# EAGLE schematic ES_3340_6HP_Rev_3 (EAGLE 9.2.1)
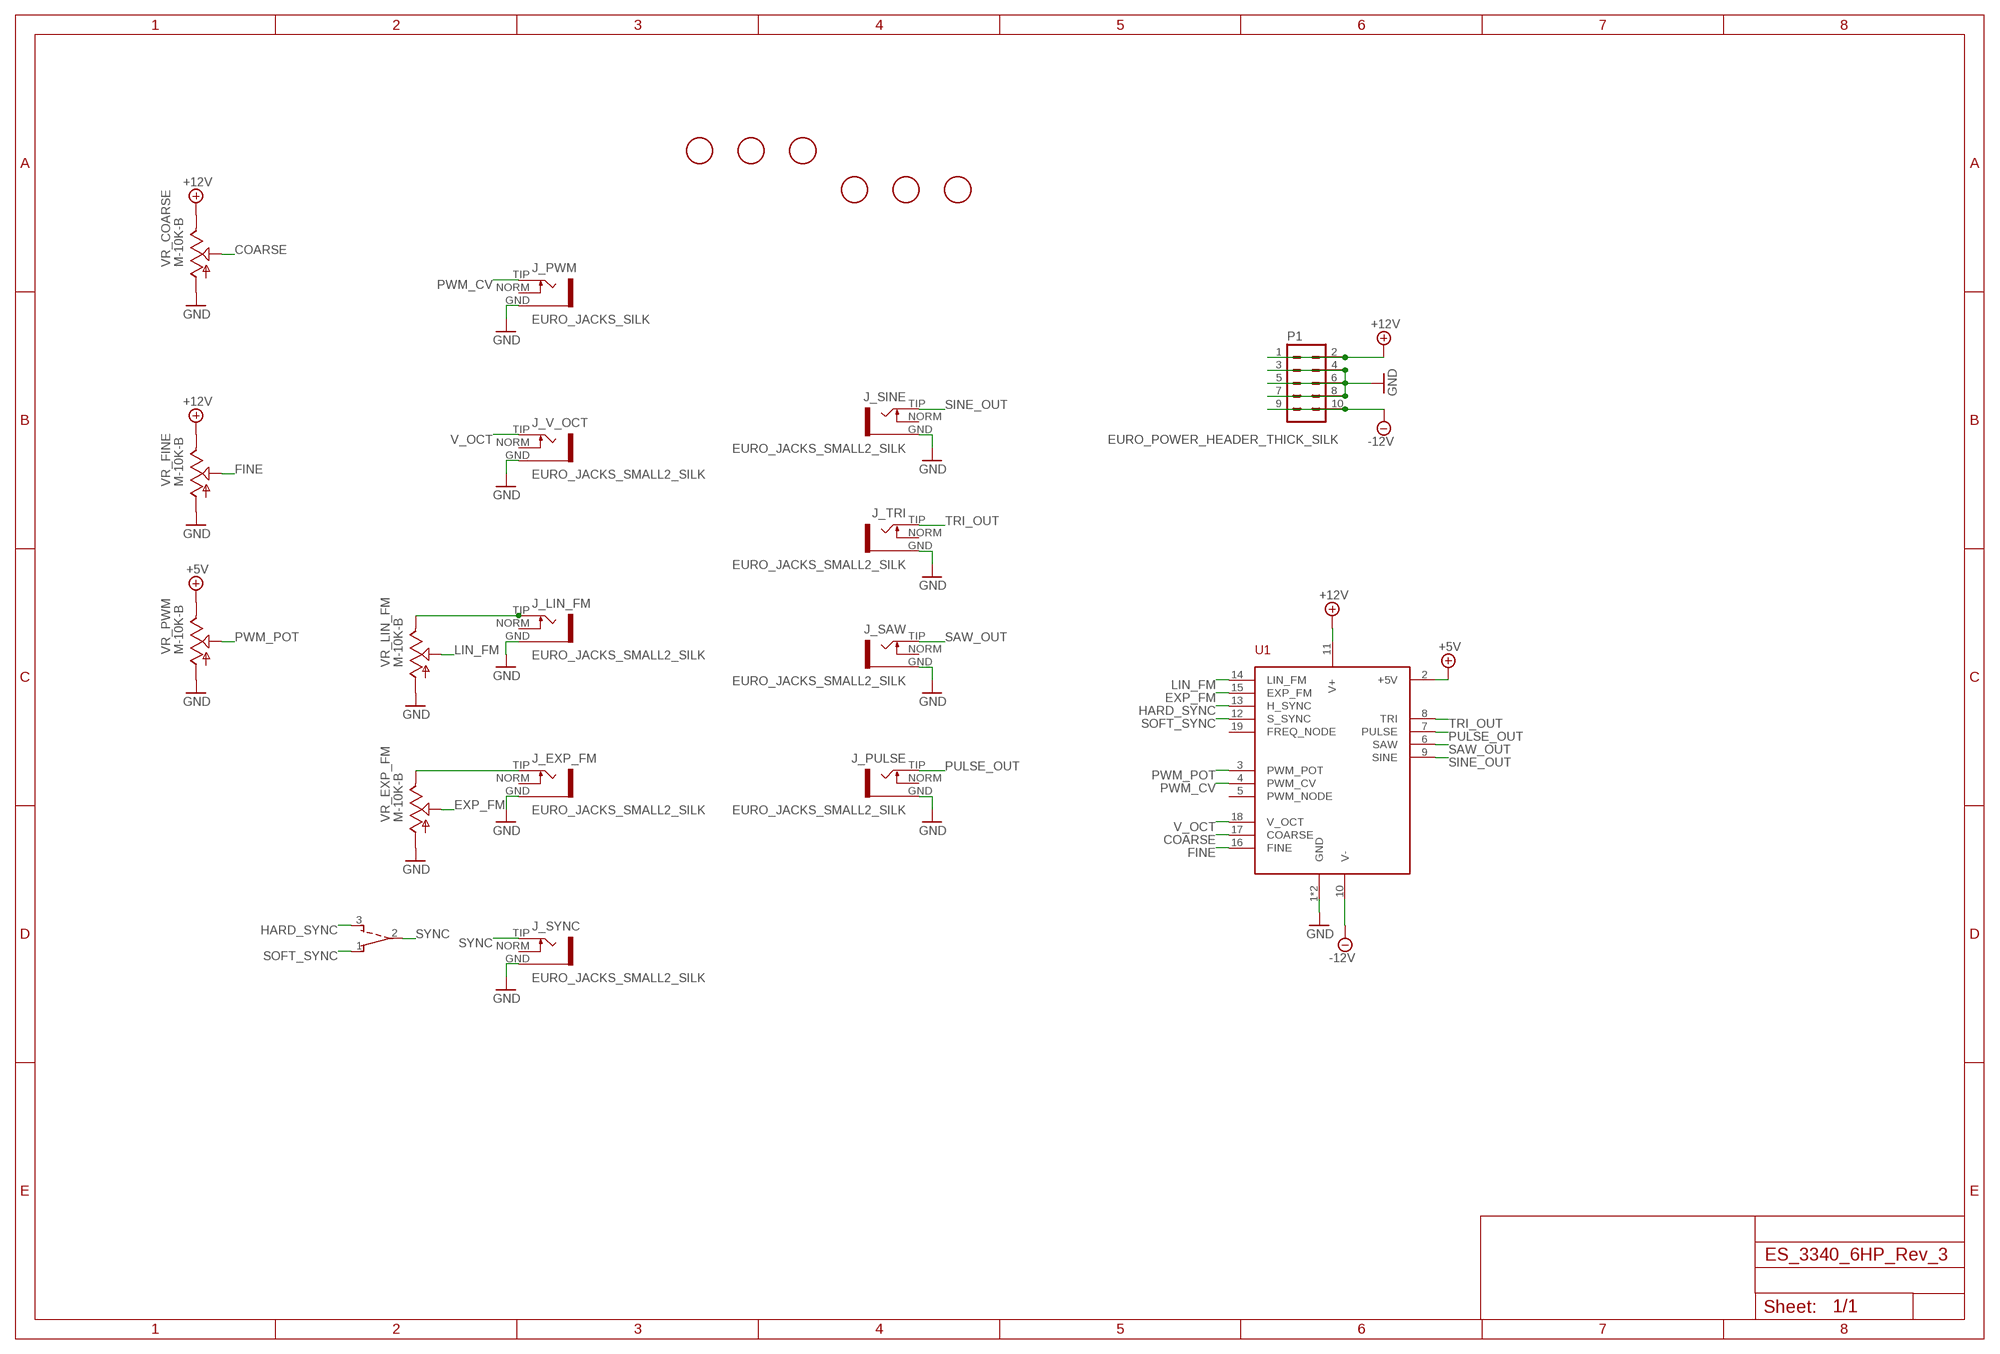
[diagram p0: schematic, sheet 1]

## Parts
FD1  FIDUCIAL  [FIDUCIAL_1MM]
FD2  FIDUCIAL  [FIDUCIAL_1MM]
FD3  FIDUCIAL  [FIDUCIAL_1MM]
FD4  FIDUCIAL  [FIDUCIAL_1MM]
FD5  FIDUCIAL  [FIDUCIAL_1MM]
FD6  FIDUCIAL  [FIDUCIAL_1MM]
J_EXP_FM  EURO_JACKS_SMALL2_SILK  [S_JACK_SMALL2_SILK]
J_LIN_FM  EURO_JACKS_SMALL2_SILK  [S_JACK_SMALL2_SILK]
J_PULSE  EURO_JACKS_SMALL2_SILK  [S_JACK_SMALL2_SILK]
J_PWM  EURO_JACKS_SILK  [S_JACK_SILK]
J_SAW  EURO_JACKS_SMALL2_SILK  [S_JACK_SMALL2_SILK]
J_SINE  EURO_JACKS_SMALL2_SILK  [S_JACK_SMALL2_SILK]
J_SYNC  EURO_JACKS_SMALL2_SILK  [S_JACK_SMALL2_SILK]
J_TRI  EURO_JACKS_SMALL2_SILK  [S_JACK_SMALL2_SILK]
J_V_OCT  EURO_JACKS_SMALL2_SILK  [S_JACK_SMALL2_SILK]
P1  EURO_POWER_HEADER_THICK_SILK  [2X5_LOCK]
SW1  TOGGLE_ON-ON  [TOGGLE_ON-ON]
U1  ES_3340_V2  [ES_3340_V2]
VR_COARSE  M-10K-B  POT_9MM_SNAP-IN__  [9MM_SNAP-IN_POT_SILK]
VR_EXP_FM  M-10K-B  POT_9MM_SNAP-IN__  [9MM_SNAP-IN_POT_SILK]
VR_FINE  M-10K-B  POT_9MM_SNAP-IN__  [9MM_SNAP-IN_POT_SILK]
VR_LIN_FM  M-10K-B  POT_9MM_SNAP-IN__  [9MM_SNAP-IN_POT_SILK]
VR_PWM  M-10K-B  POT_9MM_SNAP-IN__  [9MM_SNAP-IN_POT_SILK]

## Nets
+5V: U1.2(+5V) VR_PWM.3
+12V: P1.1 P1.2 U1.11(V+) VR_COARSE.3 VR_FINE.3
-12V: P1.9 P1.10 U1.10(V-)
COARSE: U1.17(COARSE) VR_COARSE.2
EXP_FM: U1.15(EXP_FM) VR_EXP_FM.2
FINE: U1.16(FINE) VR_FINE.2
GND: J_EXP_FM.GND J_LIN_FM.GND J_PULSE.GND J_PWM.GND J_SAW.GND J_SINE.GND J_SYNC.GND J_TRI.GND J_V_OCT.GND P1.3 P1.4 P1.5 P1.6 P1.7 P1.8 U1.1(GND) U1.20(GND) VR_COARSE.1 VR_EXP_FM.1 VR_FINE.1 VR_LIN_FM.1 VR_PWM.1
HARD_SYNC: SW1.3(S) U1.13(H_SYNC)
LIN_FM: U1.14(LIN_FM) VR_LIN_FM.2
N$1: J_LIN_FM.TIP VR_LIN_FM.3
N$2: J_EXP_FM.TIP VR_EXP_FM.3
PULSE_OUT: J_PULSE.TIP U1.7(PULSE)
PWM_CV: J_PWM.TIP U1.4(PWM_CV)
PWM_POT: U1.3(PWM_POT) VR_PWM.2
SAW_OUT: J_SAW.TIP U1.6(SAW)
SINE_OUT: J_SINE.TIP U1.9(SINE)
SOFT_SYNC: SW1.1(O) U1.12(S_SYNC)
SYNC: J_SYNC.TIP SW1.2(P)
TRI_OUT: J_TRI.TIP U1.8(TRI)
V_OCT: J_V_OCT.TIP U1.18(V_OCT)
Unconnected: J_EXP_FM.NORM J_LIN_FM.NORM J_PULSE.NORM J_PWM.NORM J_SAW.NORM J_SINE.NORM J_SYNC.NORM J_TRI.NORM J_V_OCT.NORM U1.5(PWM_NODE) U1.19(FREQ_NODE)

## Library data of the parts
FD1-FD6 = Electrosmith-Connectors:FIDUCIAL: For use by pick and place machines to calibrate the vision/machine, 1mm By microbuilder.eu
J_EXP_FM J_LIN_FM J_PULSE J_PWM J_SAW J_SINE J_SYNC J_TRI J_V_OCT = Electrosmith-Interface:EURO_JACK
P1 = Electrosmith-Connectors:EURO_POWER_HEADER: Power Header 10 pin power header for Eurorack Power Supplies Variants with fatter pads for easier soldering, and the LOCK variant which has 5mil offset pins to hold the component in place before soldering; LABEL: -12V; LABEL2: solder on this side
SW1 = Electrosmith-Interface:TOGGLE_ON-ON
U1 = Electrosmith-Boards:ES_3340_V2; LABEL: solder on this side
VR_COARSE VR_EXP_FM VR_FINE VR_LIN_FM VR_PWM = Electrosmith-Interface:POT_9MM_SNAP-IN_: 9mm vertical snap-in pot, Alpha / Panasonic style